# Altium schematic sheet MSPMain.SchDoc
size Tabloid; SheetNumber: 1; SheetTotal: 2
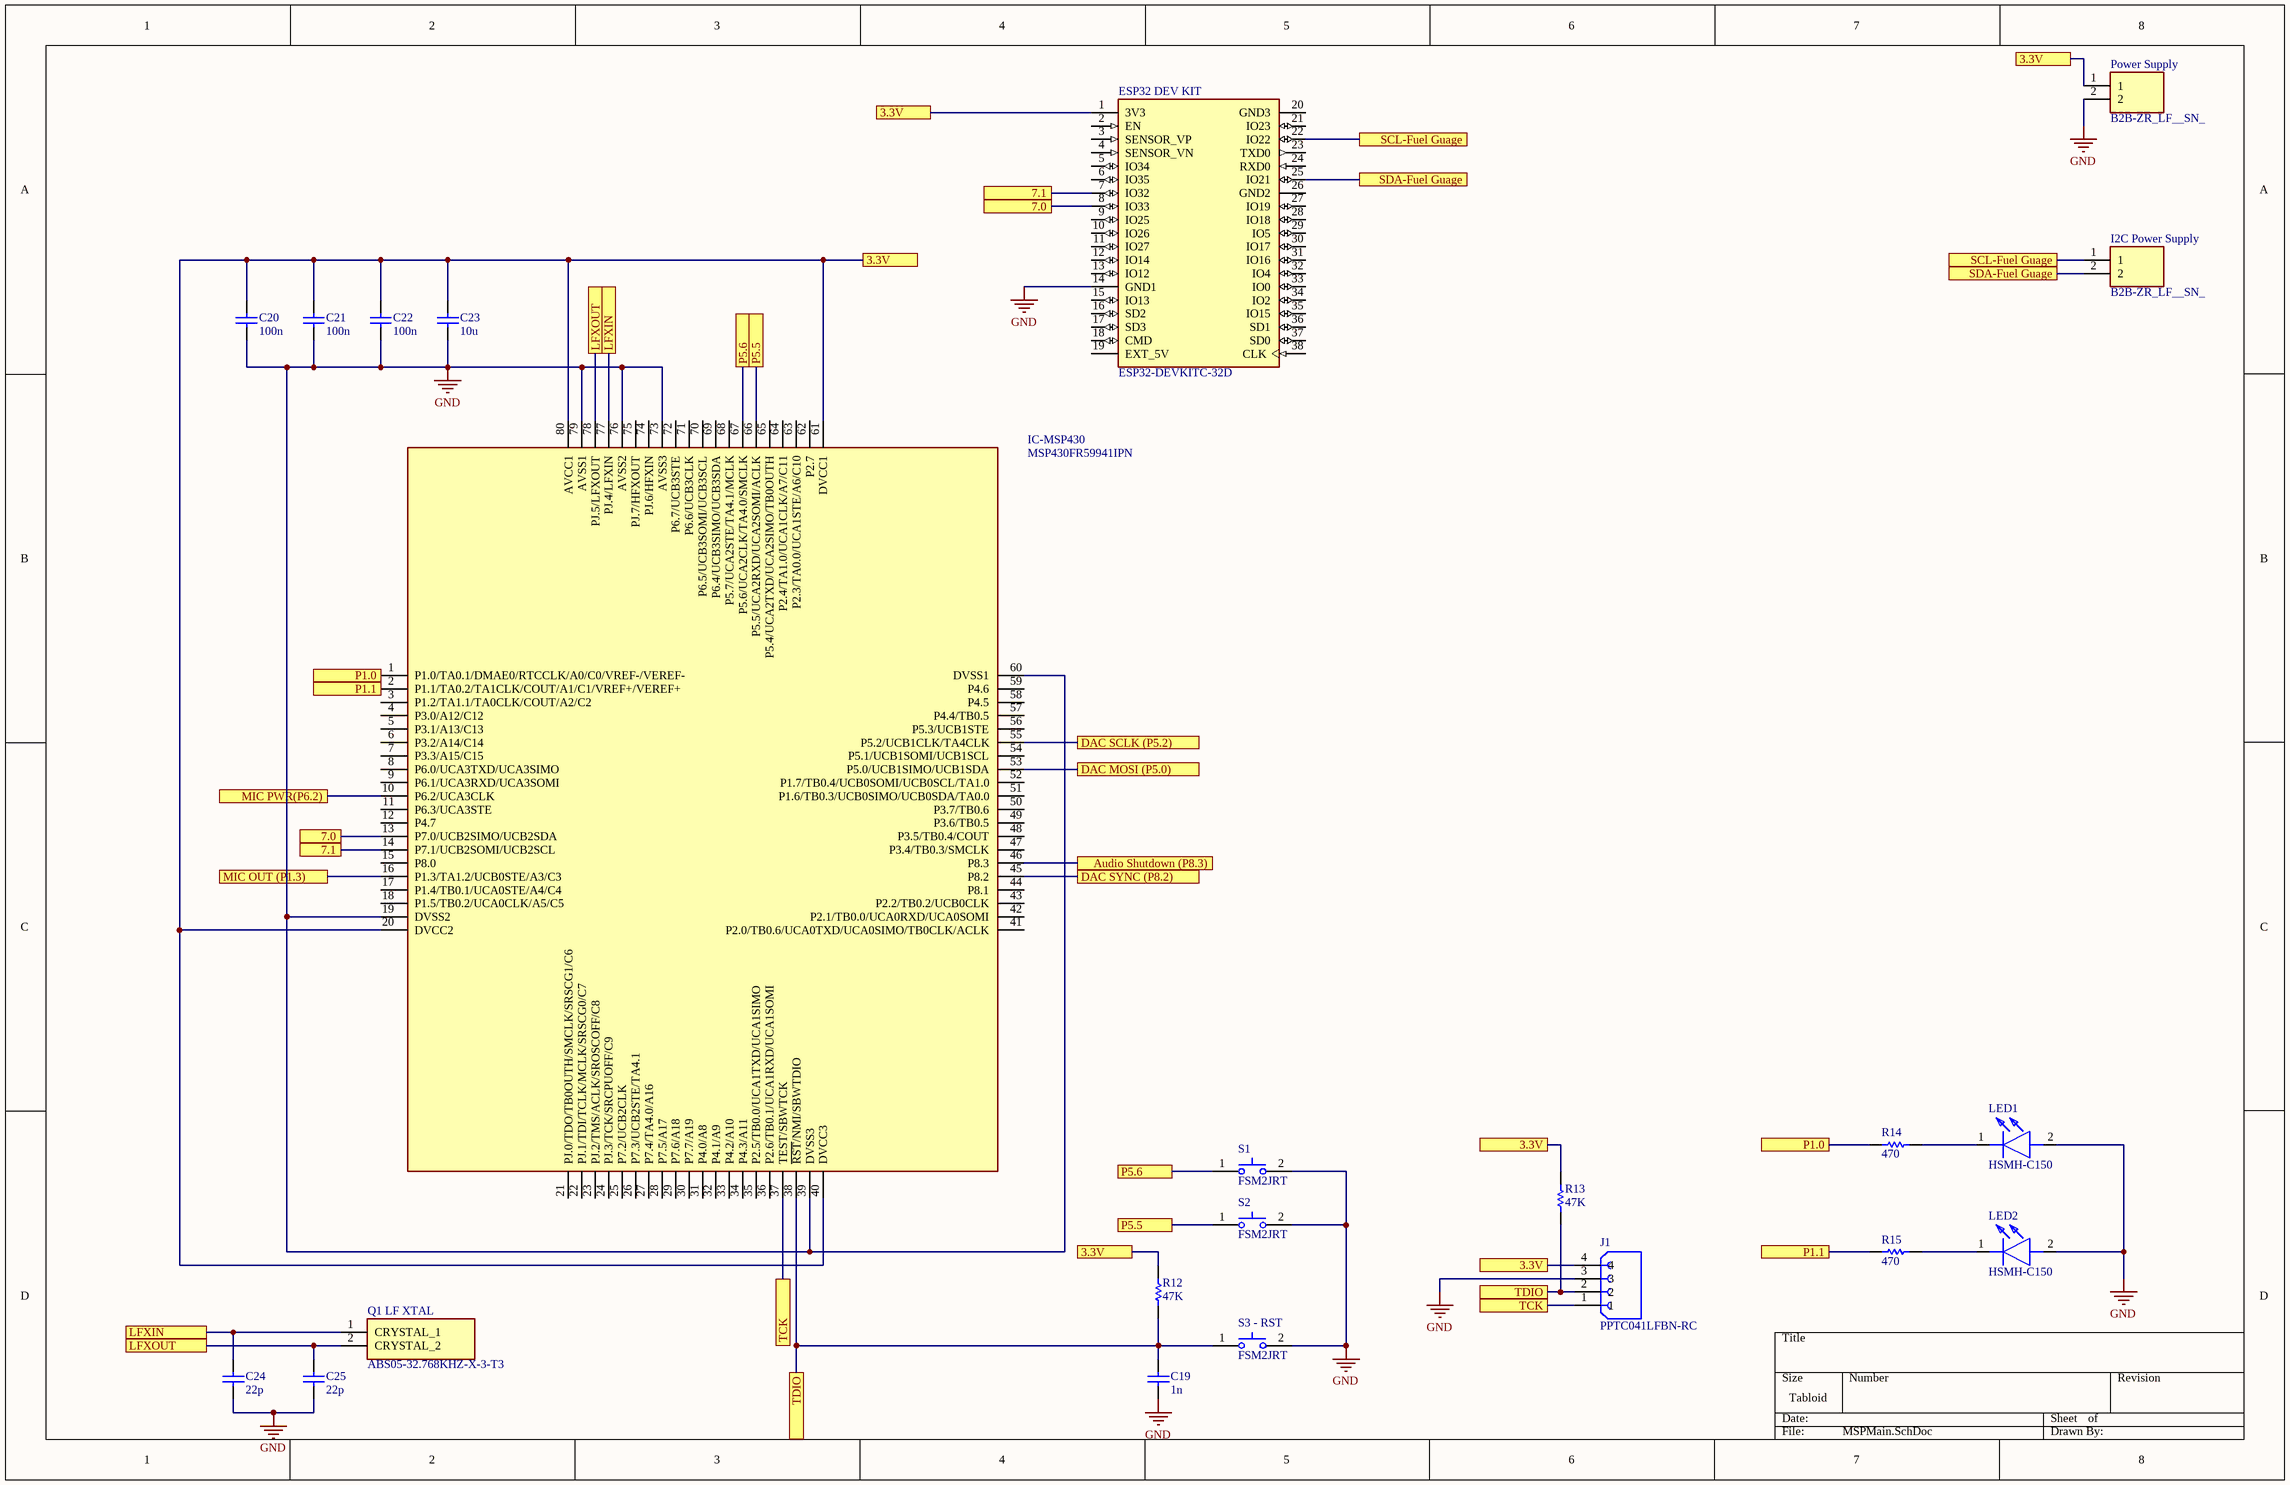
[diagram p0: MSPMain.SchDoc]

## Parts
C19  1n  [CAPC1206(3216)170_M]
C20  100n  [CAPC1206(3216)170_M]
C21  100n  [CAPC1206(3216)170_M]
C22  100n  [CAPC1206(3216)170_M]
C23  10u  [CAPC1206(3216)170_M]
C24  22p  [CAPC1206(3216)170_M]
C25  22p  [CAPC1206(3216)170_M]
ESP32_DEV_KIT  ESP32-DEVKITC-32D  [MODULE_ESP32-DEVKITC-32D]
I2C_Power_Supply  B2B-ZR_LF__SN_  [SHDR2W50P0X150_1X2_450X350X450P]
IC-MSP430  MSP430FR59941IPN  [QFP50P1400X1400X160-80N]
J1  PPTC041LFBN-RC  [SULLINS_PPTC041LFBN-RC]
LED1  HSMH-C150  [LEDC3216X120N]
LED2  HSMH-C150  [LEDC3216X120N]
Power_Supply  B2B-ZR_LF__SN_  [SHDR2W50P0X150_1X2_450X350X450P]
Q1_LF_XTAL  ABS05-32.768KHZ-X-3-T3  [ABS0532768KHZX3T3]
R12  47K  [RESC3216X60X45LL10T20]
R13  47K  [RESC3216X60X45LL10T20]
R14  470  [RESC3216X60X45NL10T20]
R15  470  [RESC3216X60X45NL10T20]
S1  FSM2JRT  [FSM2JRT]
S2  FSM2JRT  [FSM2JRT]
S3_-_RST  FSM2JRT  [FSM2JRT]

## Ports
3.3V, 7.0, 7.1, Audio Shutdown (P8.3), DAC MOSI (P5.0), DAC SCLK (P5.2), DAC SYNC (P8.2), LFXIN, LFXOUT, MIC OUT (P1.3), MIC PWR(P6.2), P1.0, P1.1, P5.5, P5.6, SCL-Fuel Guage, SDA-Fuel Guage, TCK, TDIO

## Nets
GND: C19.2 C20.2 C21.2 C22.2 C23.2 C24.2 C25.2 ESP32_DEV_KIT.14(GND1) IC-MSP430.19(DVSS2) IC-MSP430.39(DVSS3) IC-MSP430.60(DVSS1) IC-MSP430.73(AVSS3) IC-MSP430.76(AVSS2) IC-MSP430.79(AVSS1) J1.3 LED1.2(A) LED2.2(A) Power_Supply.2 S1.2(NO) S2.2(NO) S3_-_RST.2(NO)
3.3V: C20.1 C21.1 C22.1 C23.1 ESP32_DEV_KIT.1(3V3) IC-MSP430.20(DVCC2) IC-MSP430.40(DVCC3) IC-MSP430.61(DVCC1) IC-MSP430.80(AVCC1) J1.4 Power_Supply.1 R12.2 R13.2 ; port 3.3V
7.0: ESP32_DEV_KIT.8(IO33) IC-MSP430.13(P7.0/UCB2SIMO/UCB2SDA) ; port 7.0
7.1: ESP32_DEV_KIT.7(IO32) IC-MSP430.14(P7.1/UCB2SOMI/UCB2SCL) ; port 7.1
Audio Shutdown (P8.3): IC-MSP430.46(P8.3) ; port Audio Shutdown (P8.3)
DAC MOSI (P5.0): IC-MSP430.53(P5.0/UCB1SIMO/UCB1SDA) ; port DAC MOSI (P5.0)
DAC SCLK (P5.2): IC-MSP430.55(P5.2/UCB1CLK/TA4CLK) ; port DAC SCLK (P5.2)
DAC SYNC (P8.2): IC-MSP430.45(P8.2) ; port DAC SYNC (P8.2)
LFXIN: C24.1 IC-MSP430.77(PJ.4/LFXIN) Q1_LF_XTAL.1(CRYSTAL_1) ; port LFXIN
LFXOUT: C25.1 IC-MSP430.78(PJ.5/LFXOUT) Q1_LF_XTAL.2(CRYSTAL_2) ; port LFXOUT
MIC OUT (P1.3): IC-MSP430.16(P1.3/TA1.2/UCB0STE/A3/C3) ; port MIC OUT (P1.3)
MIC PWR(P6.2): IC-MSP430.10(P6.2/UCA3CLK) ; port MIC PWR(P6.2)
P1.0: IC-MSP430.1(P1.0/TA0.1/DMAE0/RTCCLK/A0/C0/VREF-/VEREF-) R14.1 ; port P1.0
P1.1: IC-MSP430.2(P1.1/TA0.2/TA1CLK/COUT/A1/C1/VREF+/VEREF+) R15.1 ; port P1.1
P5.5: IC-MSP430.66(P5.5/UCA2RXD/UCA2SOMI/ACLK) S2.1(COM) ; port P5.5
P5.6: IC-MSP430.67(P5.6/UCA2CLK/TA4.0/SMCLK) S1.1(COM) ; port P5.6
SCL-Fuel Guage: ESP32_DEV_KIT.22(IO22) I2C_Power_Supply.1 ; port SCL-Fuel Guage
SDA-Fuel Guage: ESP32_DEV_KIT.25(IO21) I2C_Power_Supply.2 ; port SDA-Fuel Guage
TCK: IC-MSP430.37(TEST/SBWTCK) J1.1 ; port TCK
TDIO: C19.1 IC-MSP430.38(~{RST}/NMI/SBWTDIO) J1.2 R12.1 R13.1 S3_-_RST.1(COM) ; port TDIO
NetLED1_1: LED1.1(K) R14.2
NetLED2_1: LED2.1(K) R15.2

Not connected (* = marked no-connect by the designer): ESP32_DEV_KIT 2(EN) 3(SENSOR_VP) 4(SENSOR_VN) 5(IO34) 6(IO35) 9(IO25) 10(IO26) 11(IO27) 12(IO14) 13(IO12) 15(IO13) 16(SD2) 17(SD3) 18(CMD) 19(EXT_5V) 20(GND3) 21(IO23) 23(TXD0) 24(RXD0) 26(GND2) 27(IO19) 28(IO18) 29(IO5) 30(IO17) 31(IO16) 32(IO4) 33(IO0) 34(IO2) 35(IO15) 36(SD1) 37(SD0) 38(CLK); IC-MSP430 3(P1.2/TA1.1/TA0CLK/COUT/A2/C2) 4(P3.0/A12/C12) 5(P3.1/A13/C13) 6(P3.2/A14/C14) 7(P3.3/A15/C15) 8(P6.0/UCA3TXD/UCA3SIMO) 9(P6.1/UCA3RXD/UCA3SOMI) 11(P6.3/UCA3STE) 12(P4.7) 15(P8.0) 17(P1.4/TB0.1/UCA0STE/A4/C4) 18(P1.5/TB0.2/UCA0CLK/A5/C5) 21(PJ.0/TDO/TB0OUTH/SMCLK/SRSCG1/C6) 22(PJ.1/TDI/TCLK/MCLK/SRSCG0/C7) 23(PJ.2/TMS/ACLK/SROSCOFF/C8) 24(PJ.3/TCK/SRCPUOFF/C9) 25(P7.2/UCB2CLK) 26(P7.3/UCB2STE/TA4.1) 27(P7.4/TA4.0/A16) 28(P7.5/A17) 29(P7.6/A18) 30(P7.7/A19) 31(P4.0/A8) 32(P4.1/A9) 33(P4.2/A10) 34(P4.3/A11) 35(P2.5/TB0.0/UCA1TXD/UCA1SIMO) 36(P2.6/TB0.1/UCA1RXD/UCA1SOMI) 41(P2.0/TB0.6/UCA0TXD/UCA0SIMO/TB0CLK/ACLK) 42(P2.1/TB0.0/UCA0RXD/UCA0SOMI) 43(P2.2/TB0.2/UCB0CLK) 44(P8.1) 47(P3.4/TB0.3/SMCLK) 48(P3.5/TB0.4/COUT) 49(P3.6/TB0.5) 50(P3.7/TB0.6) 51(P1.6/TB0.3/UCB0SIMO/UCB0SDA/TA0.0) 52(P1.7/TB0.4/UCB0SOMI/UCB0SCL/TA1.0) 54(P5.1/UCB1SOMI/UCB1SCL) 56(P5.3/UCB1STE) 57(P4.4/TB0.5) 58(P4.5) 59(P4.6) 62(P2.7) 63(P2.3/TA0.0/UCA1STE/A6/C10) 64(P2.4/TA1.0/UCA1CLK/A7/C11) 65(P5.4/UCA2TXD/UCA2SIMO/TB0OUTH) 68(P5.7/UCA2STE/TA4.1/MCLK) 69(P6.4/UCB3SIMO/UCB3SDA) 70(P6.5/UCB3SOMI/UCB3SCL) 71(P6.6/UCB3CLK) 72(P6.7/UCB3STE) 74(PJ.6/HFXIN) 75(PJ.7/HFXOUT)

## Library data of the parts
C19-C25 = CMP-1037-03299-1: CAP 6.8nF 50V ±10% 1206 (3216 Metric) Thickness 1.7mm SMD; Tolerance: Â±10%; Case-EIA: 1206; Case-Metric: 3216; Value: 6.8nF; Technology: SMT; Rated Voltage: 50 V; Max Thickness: 1.7 mm
ESP32_DEV_KIT = ESP32-DEVKITC-32D: EVAL BOARD FOR ESP-WROOM-32; MF: Espressif Systems; Value: *; MP: ESP32-DEVKITC-32D; Price: None; Check_prices: https://www.snapeda.com/parts/ESP32-DEVKITC-32D/Espressif%20Systems/view-part/2777395/?ref=eda; SnapEDA_Link: https://www.snapeda.com/parts/ESP32-DEVKITC-32D/Espressif%20Systems/view-part/2777395/?ref=snap; Availability: Warning; Purchase-URL: https://pricing.snapeda.com/search/part/ESP32-DEVKITC-32D/?ref=eda; Package: None
I2C_Power_Supply Power_Supply = B2B-ZR_LF__SN_: Connector; Manufacturer_Name: JST (JAPAN SOLDERLESS TERMINALS); Manufacturer_Part_Number: B2B-ZR(LF)(SN); Datasheet Link: https://componentsearchengine.com/Datasheets/2/B2B-ZR(LF)(SN).pdf; Height: 4.5mm; Arrow Part Number: B2B-ZR(LF)(SN); Arrow Price/Stock: https://www.arrow.com/en/products/b2b-zr-lf-sn/jst-manufacturing
IC-MSP430 = MSP430FR59941IPN: Integrated Circuit; Manufacturer_Name: Texas Instruments; Datasheet Link: http://www.ti.com/lit/gpn/MSP430FR59941; Height: 1.6mm; Mouser2 Part Number: 595-MSP430FR59941IPN; Mouser2 Price/Stock: https://www.mouser.com/Search/Refine.aspx?Keyword=595-MSP430FR59941IPN; Manufacturer_Part_Number: MSP430FR59941IPN
J1 = PPTC041LFBN-RC: 4 Position Header Connector Through Hole; MF: Sullins Connector; MP: PPTC041LFBN-RC; Value: *; SnapEDA_Link: https://www.snapeda.com/parts/PPTC041LFBN-RC/Sullins%20Connector%20Solutions/view-part/285917/?ref=snap; Package: None; Availability: Warning; Check_prices: https://www.snapeda.com/parts/PPTC041LFBN-RC/Sullins%20Connector%20Solutions/view-part/285917/?ref=eda; Price: None; Purchase-URL: https://pricing.snapeda.com/search/part/PPTC041LFBN-RC/?ref=eda
LED1 LED2 = HSMH-C150: LED; Manufacturer_Name: Avago Technologies; Height: 1.2mm; Mouser2 Part Number: 630-HSMH-C150; Mouser2 Price/Stock: https://www.mouser.com/Search/Refine.aspx?Keyword=630-HSMH-C150; Manufacturer_Part_Number: HSMH-C150
Q1_LF_XTAL = ABS05-32.768KHZ-X-3-T3: Crystal or Oscillator; Manufacturer_Name: ABRACON; Datasheet Link: https://abracon.com/Resonators/ABS05.pdf; Height: 0.5mm; Manufacturer_Part_Number: ABS05-32.768KHZ-X-3-T3
R12 R13 = CMP-2003-02213-1: Part Number: CRCW120647K0FKEA; Manufacturer: Vishay Dale
R14 R15 = CMP-1014-00812-2: Part Number: CRCW1206470KFKEA; Manufacturer: Vishay Dale
S1 S2 S3_-_RST = FSM2JRT: Switch (2-Pin Push); Manufacturer_Name: TE Connectivity; Height: 4.3mm; Manufacturer_Part_Number: FSM2JRT